# Altium schematic sheet ESC_prototype_1_schematic.SchDoc
size 420 x 297 mm; SheetNumber: 1; SheetTotal: 1
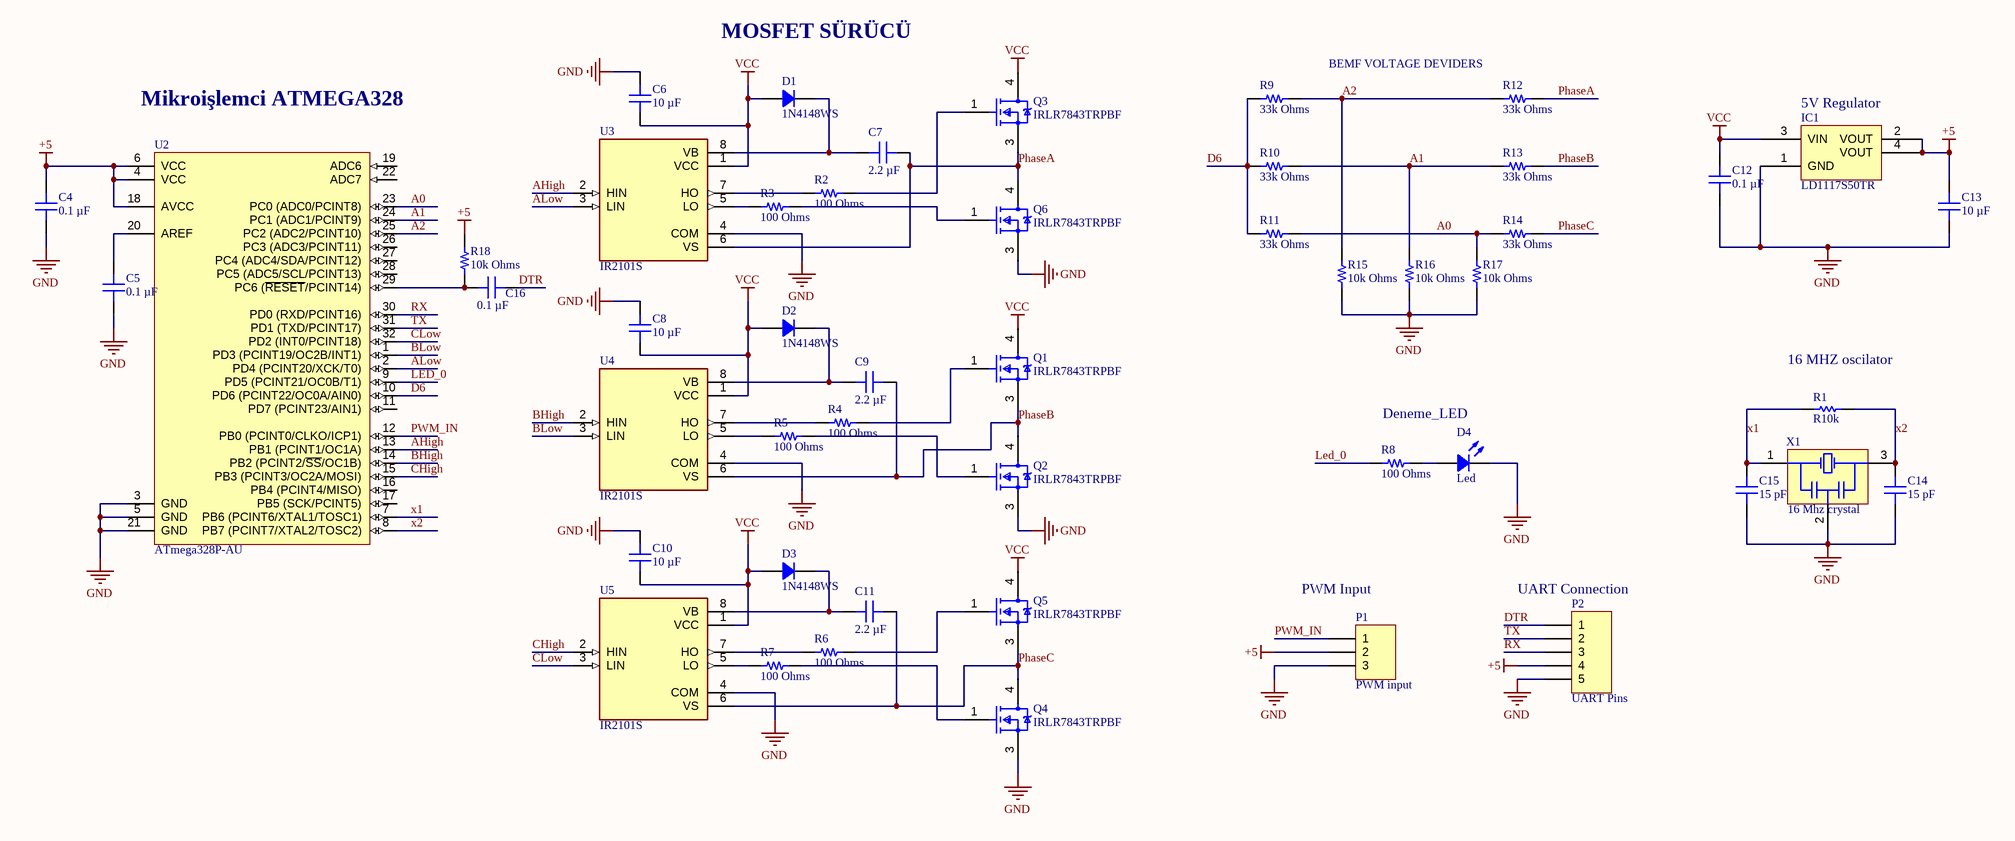
[diagram p0: ESC_prototype_1_schematic.SchDoc]

## Parts
C4  0.1 µF  [CAP 0805_2012]
C5  0.1 µF  [CAP 0805_2012]
C6  10 µF  [CAP 1206_3216 - 0.8MM]
C7  2.2 µF  [CAP 0805_2012]
C8  10 µF  [CAP 1206_3216 - 0.8MM]
C9  2.2 µF  [CAP 0805_2012]
C10  10 µF  [CAP 1206_3216 - 0.8MM]
C11  2.2 µF  [CAP 0805_2012]
C12  0.1 µF  [CAP 0805_2012]
C13  10 µF  [CAP 1206_3216 - 0.8MM]
C14  15 pF  [CAP 0805_2012]
C15  value 15 pF  [CAP 0805_2012]  (hidden comment: 15)
C16  0.1 µF  [CAP 0805_2012]
D1  1N4148WS  [SOD323F]
D2  1N4148WS  [SOD323F]
D3  1N4148WS  [SOD323F]
D4  Led  [CREE J 2835]
IC1  LD1117S50TR  [ST SOT-223]
P1  PWM input  [HDR1X3]
P2  UART Pins  [HDR1X5]
Q1  IRLR7843TRPBF  [FP-PG-TO252-3-MFG]
Q2  IRLR7843TRPBF  [FP-PG-TO252-3-MFG]
Q3  IRLR7843TRPBF  [FP-PG-TO252-3-MFG]
Q4  IRLR7843TRPBF  [FP-PG-TO252-3-MFG]
Q5  IRLR7843TRPBF  [FP-PG-TO252-3-MFG]
Q6  IRLR7843TRPBF  [FP-PG-TO252-3-MFG]
R1  R10k  [RESC1608X55X25ML10T15]
R2  100 Ohms  [RES 0603_1608]
R3  100 Ohms  [RES 0603_1608]
R4  100 Ohms  [RES 0603_1608]
R5  100 Ohms  [RES 0603_1608]
R6  100 Ohms  [RES 0603_1608]
R7  100 Ohms  [RES 0603_1608]
R8  100 Ohms  [RES 0603_1608]
R9  33k Ohms  [RES 0603_1608]
R10  33k Ohms  [RES 0603_1608]
R11  33k Ohms  [RES 0603_1608]
R12  33k Ohms  [RES 0603_1608]
R13  33k Ohms  [RES 0603_1608]
R14  33k Ohms  [RES 0603_1608]
R15  10k Ohms  [RES 0603_1608]
R16  10k Ohms  [RES 0603_1608]
R17  10k Ohms  [RES 0603_1608]
R18  10k Ohms  [RES 0603_1608]
U2  ATmega328P-AU  [32A_M]
U3  IR2101S  [SOIC127P600X175-8N]
U4  IR2101S  [SOIC127P600X175-8N]
U5  IR2101S  [SOIC127P600X175-8N]
X1  16 Mhz crystal  [MURA-CSTCE_G_A-3_V]

## Nets
+5: C4.2 C13.2 IC1.2(VOUT) IC1.4(VOUT) P1.2 P2.4 R18.2 U2.4(VCC) U2.6(VCC) U2.18(AVCC)
GND: C4.1 C5.1 C6.2 C8.2 C10.2 C12.1 C13.1 C14.1 C15.1 D4.2 IC1.1(GND) P1.3 P2.5 Q2.3(SOURCE) Q4.3(SOURCE) Q6.3(SOURCE) R15.1 R16.1 R17.1 U2.3(GND) U2.5(GND) U2.21(GND) U3.4(COM) U4.4(COM) U5.4(COM) X1.2(GND)
VCC: C6.1 C8.1 C10.1 C12.2 D1.1 D2.1 D3.1 IC1.3(VIN) Q1.4(DRAIN) Q3.4(DRAIN) Q5.4(DRAIN) U3.1(VCC) U4.1(VCC) U5.1(VCC)
A0: R11.2 R14.1 R17.2 U2.23(PC0_(ADC0/PCINT8))
A1: R10.2 R13.1 R16.2 U2.24(PC1_(ADC1/PCINT9))
A2: R9.2 R12.1 R15.2 U2.25(PC2_(ADC2/PCINT10))
AHigh: U2.13(PB1_(PCINT1/OC1A)) U3.2(HIN)
ALow: U2.2(PD4_(PCINT20/XCK/T0)) U3.3(LIN)
BHigh: U2.14(PB2_(PCINT2/~{SS}/OC1B)) U4.2(HIN)
BLow: U2.1(PD3_(PCINT19/OC2B/INT1)) U4.3(LIN)
CHigh: U2.15(PB3_(PCINT3/OC2A/MOSI)) U5.2(HIN)
CLow: U2.32(PD2_(INT0/PCINT18)) U5.3(LIN)
D6: R9.1 R10.1 R11.1 U2.10(PD6_(PCINT22/OC0A/AIN0))
DTR: C16.2 P2.1
LED_0: R8.1 U2.9(PD5_(PCINT21/OC0B/T1))
PhaseA: C7.2 Q3.3(SOURCE) Q6.4(DRAIN) R12.2 U3.6(VS)
PhaseB: C9.2 Q1.3(SOURCE) Q2.4(DRAIN) R13.2 U4.6(VS)
PhaseC: C11.2 Q4.4(DRAIN) Q5.3(SOURCE) R14.2 U5.6(VS)
PWM_IN: P1.1 U2.12(PB0_(PCINT0/CLKO/ICP1))
RX: P2.3 U2.30(PD0_(RXD/PCINT16))
TX: P2.2 U2.31(PD1_(TXD/PCINT17))
x1: C15.2 R1.2 U2.7(PB6_(PCINT6/XTAL1/TOSC1)) X1.1(X1)
x2: C14.2 R1.1 U2.8(PB7_(PCINT7/XTAL2/TOSC2)) X1.3(X2)
NetC5_2: C5.2 U2.20(AREF)
NetC7_1: C7.1 D1.2 U3.8(VB)
NetC9_1: C9.1 D2.2 U4.8(VB)
NetC11_1: C11.1 D3.2 U5.8(VB)
NetC16_1: C16.1 R18.1 U2.29(PC6_(~{RESET}/PCINT14))
NetD4_1: D4.1 R8.2
NetQ1_1: Q1.1(GATE) R4.2
NetQ2_1: Q2.1(GATE) R5.2
NetQ3_1: Q3.1(GATE) R2.2
NetQ4_1: Q4.1(GATE) R7.2
NetQ5_1: Q5.1(GATE) R6.2
NetQ6_1: Q6.1(GATE) R3.2
NetR2_1: R2.1 U3.7(HO)
NetR3_1: R3.1 U3.5(LO)
NetR4_1: R4.1 U4.7(HO)
NetR5_1: R5.1 U4.5(LO)
NetR6_1: R6.1 U5.7(HO)
NetR7_1: R7.1 U5.5(LO)

Not connected (* = marked no-connect by the designer): U2 11(PD7_(PCINT23/AIN1)) 16(PB4_(PCINT4/MISO)) 17(PB5_(SCK/PCINT5)) 19(ADC6) 22(ADC7) 26(PC3_(ADC3/PCINT11)) 27(PC4_(ADC4/SDA/PCINT12)) 28(PC5_(ADC5/SCL/PCINT13))

## Notes on the sheet
- MOSFET SÜRÜCÜ
- BEMF VOLTAGE DEVIDERS
- Mikroişlemci ATMEGA328
- (near IC1) 5V Regulator
- Deneme_LED
- (near R1) 16 MHZ oscilator
- (near P1) PWM Input
- (near P2) UART Connection
- THIS DOCUMENT AND THE DATA DISCLOSED HEREIN OR
- HEREWITH IS THE PROPERTY OF ALTIUM LIMITED AND MAY
- DWG NO:
- REVISION
- REV:
- DESCRIPTION
- DATE
- APPROVED
- BE FREELY DISTRIBUTED IN WHOLE. NO RIGHTS ARE
- RESERVED OR EXPRESS OR IMPLIED WARANTEE GIVEN.
- ENG:
- APPROVALS
- PROJECT
- DSN:
- CHK:
- REFERENCE DOCUMENTS
- PROJECT REVISION:
- TITLE
- DOCUMENT REVISION:
- DESIGN ITEM:
- BOM:
- FAB DWG:
- PCB DWG:
- ASSY DWG:
- SCALE:
- A3
- SIZE
- CAGE CODE
- FILE NAME
- DWG NO.
- SHEET
- OF
- REV

## Library data of the parts
C4 C5 C12 C16 = CL21B104KBCNNNC: CAP CER 0.1UF 50V X7R 0805; manufacturer: Samsung Electro-Mechanics; Tolerance: ±10%; Part Number: CL21B104KBCNNNC; Value: 0.1 µF; Applications: General Purpose; Capacitance: 0.1 µF; componentlink1description: Datasheet; componentlink1url: http://www.samsungsem.com/kr/support/product-search/mlcc/CL21B104KBCNNNC.jsp; componentlink2description: DigiKey Link; componentlink2url: https://www.digikey.com/en/products/detail/samsung-electro-mechanics/CL21B104KBCNNNC/3886661; Device Package: 0805 (2012 Metric); Lifecycle Status: Active; Minimum Order: 1; Mounting Type: Surface Mount, MLCC; Operating Temperature: -55°C ~ 125°C; Package / Case: 0805 (2012 Metric); packaging: TapeAndReel; partid: 6201; Part Status: Active; price: 0.01; series: CL; Size / Dimension: 0.079" L x 0.049" W (2.00mm x 1.25mm); Supplier 1: DigiKey; Supplier Part Number 1: 1276-1003-1-ND; Temperature Coefficient: X7R; Thickness (Max): 0.037" (0.95mm); Voltage - Rated: 50V
  C4 C5: lastupdated: 3/11/2022 5:29:47 AM
  C12 C16: lastupdated: 3/17/2022 8:29:34 AM
C6 C8 C10 C13 = CL31A106KACLNNC: CAP CER 10UF 25V X5R 1206; manufacturer: Samsung Electro-Mechanics; Tolerance: ±10%; Part Number: CL31A106KACLNNC; Value: 10 µF; Applications: General Purpose; Capacitance: 10 µF; componentlink1description: Datasheet; componentlink1url: http://www.samsungsem.com/kr/support/product-search/mlcc/CL31A106KACLNNC.jsp; componentlink2description: DigiKey Link; componentlink2url: https://www.digikey.com/en/products/detail/samsung-electro-mechanics/CL31A106KACLNNC/3888378; Device Package: 1206 (3216 Metric); Features: Low Profile; lastupdated: 3/11/2022 5:31:45 AM; Lifecycle Status: Active; Minimum Order: 1; Mounting Type: Surface Mount, MLCC; Operating Temperature: -55°C ~ 85°C; Package / Case: 1206 (3216 Metric); packaging: TapeAndReel; partid: 20311; Part Status: Active; price: 0.04; series: CL; Size / Dimension: 0.126" L x 0.063" W (3.20mm x 1.60mm); Supplier 1: DigiKey; Supplier Part Number 1: 1276-2720-1-ND; Temperature Coefficient: X5R; Thickness (Max): 0.037" (0.95mm); Voltage - Rated: 25V
C7 C9 C11 = CL21A225KBFNNNE: CAP CER 2.2UF 50V X5R 0805; manufacturer: Samsung Electro-Mechanics; Tolerance: ±10%; Part Number: CL21A225KBFNNNE; Value: 2.2 µF; Applications: General Purpose; Capacitance: 2.2 µF; componentlink1description: Datasheet; componentlink1url: http://www.samsungsem.com/kr/support/product-search/mlcc/CL21A225KBFNNNE.jsp; componentlink2description: DigiKey Link; componentlink2url: https://www.digikey.com/en/products/detail/samsung-electro-mechanics/CL21A225KBFNNNE/5961186; Device Package: 0805 (2012 Metric); lastupdated: 3/11/2022 5:29:51 AM; Lifecycle Status: Active; Minimum Order: 1; Mounting Type: Surface Mount, MLCC; Operating Temperature: -55°C ~ 85°C; Package / Case: 0805 (2012 Metric); packaging: TapeAndReel; partid: 4762; Part Status: Active; price: 0.04; series: CL; Size / Dimension: 0.079" L x 0.049" W (2.00mm x 1.25mm); Supplier 1: DigiKey; Supplier Part Number 1: 1276-6702-1-ND; Temperature Coefficient: X5R; Thickness (Max): 0.053" (1.35mm); Voltage - Rated: 50V
C14 C15 = CL21C101JB61PNC: CAP CER 100PF 50V C0G/NP0 0805; manufacturer: Samsung Electro-Mechanics; Temperature Coefficient: C0G, NP0; Tolerance: ±5%; Part Number: CL21C101JB61PNC; Applications: Automotive; Capacitance: 15 pF; componentlink1description: Datasheet; componentlink1url: http://www.samsungsem.com/kr/support/product-search/mlcc/CL21C101JB61PNC.jsp; componentlink2description: DigiKey Link; componentlink2url: https://www.digikey.com/en/products/detail/samsung-electro-mechanics/CL21C101JB61PNC/3888225; Device Package: 0805 (2012 Metric); lastupdated: 3/17/2022 8:29:31 AM; Lifecycle Status: Active; Minimum Order: 1; Mounting Type: Surface Mount, MLCC; Operating Temperature: -55°C ~ 125°C; Package / Case: 0805 (2012 Metric); packaging: TapeAndReel; partid: 7790; Part Status: Active; price: 0.02; Ratings: AEC-Q200; series: CL; Size / Dimension: 0.079" L x 0.049" W (2.00mm x 1.25mm); Supplier 1: DigiKey; Supplier Part Number 1: 1276-2567-1-ND; Thickness (Max): 0.028" (0.70mm); Voltage - Rated: 50V
  C14: Value: 15 pF
D1-D3 = 1N4148WS: DIODE GEN PURP 75V 150MA SOD323F; Manufacturer: ON Semiconductor; Current - Reverse Leakage @ Vr: 5µA @ 75V; Diode Type: Standard; Reverse Recovery Time (trr): 4ns; Speed: Small Signal =< 200mA (Io), Any Speed; Voltage - Forward (Vf) (Max) @ If: 1V @ 10mA; Part Number: 1N4148WS; ComponentLink1Description: Datasheet; ComponentLink1URL: https://www.onsemi.com/pub/Collateral/1N914BWS-D.pdf; ComponentLink2Description: DigiKey Link; ComponentLink2URL: http://digikey.com/product-detail/en/on-semiconductor/1N4148WS/1N4148WSFSCT-ND/1873821; Current - Average Rectified (Io): 150mA; LastUpdated: 3/11/2022 6:04:11 AM; Lifecycle Status: Active; Minimum Order: 1; Mounting Type: Surface Mount; Operating Temperature - Junction: 150°C (Max); Package / Case: SC-90, SOD-323F; Packaging: TapeAndReel; PartId: 1158; Part Status: Active; Price: 0.03; Series: -; Supplier 1: DigiKey; Supplier Part Number 1: 1N4148WSFSCT-ND; Supplier Device Package: SOD-323F; Voltage - DC Reverse (Vr) (Max): 75V
D4 = JE2835AWT-R-H30GA0000-N0000001: LED WHITE  3000K JE2835 3V; Manufacturer: Cree Inc.; CCT (K): 3000K 3-Step MacAdam Ellipse; CRI (Color Rendering Index): 80; Current - Max: 240mA; Current - Test: 150mA; Flux @ 25°C, Current - Test: 70lm (Typ); Flux @ 85°C, Current - Test: 60lm (Typ); Lumens/Watt @ Current - Test: 158 lm/W; Viewing Angle: 120°; Voltage - Forward (Vf) (Typ): 2.95V; Part Number: JE2835AWT-R-H30GA0000-N0000001; ComponentLink1Description: Datasheet; ComponentLink1URL: https://www.cree.com/led-components/media/documents/data-sheet-JSeries-2835-3v.pdf; ComponentLink2Description: DigiKey Link; ComponentLink2URL: http://digikey.com/product-detail/en/cree-inc/JE2835AWT-R-H30GA0000-N0000001/2138-JE2835AWT-R-H30GA0000-N0000001CT-ND/10820199; Device Package: 1113 (2835 Metric); LastUpdated: 3/11/2022 6:21:18 AM; Lifecycle Status: Active; Minimum Order: 1; Mounting Type: Surface Mount; Package / Case: 1113 (2835 Metric); Packaging: TapeAndReel; PartId: 60; Part Status: 1113 (2835 Metric); Price: 0.01; Series: J; Supplier 1: DigiKey; Supplier Part Number 1: 2138-JE2835AWT-R-H30GA0000-N0000001CT-ND; Supplier Device Package: SMD
IC1 = LD1117S50TR: IC REG LINEAR 5V 800MA SOT223; Manufacturer: STMicroelectronics; Current - Quiescent (Iq): 10mA; Number of Regulators: 1; Output Configuration: Positive; Output Type: Fixed; Protection Features: Over Current, Over Temperature; PSRR: 75dB (120Hz); Voltage Dropout (Max): 1.2V @ 800mA; Voltage - Input (Max): 15V; Part Number: LD1117S50TR; ComponentLink1Description: Datasheet; ComponentLink1URL: http://www.st.com/content/ccc/resource/technical/document/datasheet/99/3b/7d/91/91/51/4b/be/CD00000544.pdf/files/CD00000544.pdf/jcr:content/translations/en.CD00000544.pdf; ComponentLink2Description: DigiKey Link; ComponentLink2URL: http://digikey.com/product-detail/en/stmicroelectronics/LD1117S50TR/497-6447-1-ND/1865475; Current - Output: 800mA; LastUpdated: 3/17/2022 9:08:52 AM; Lifecycle Status: Active; Minimum Order: 1; Mounting Type: Surface Mount; Package / Case: TO-261-4, TO-261AA; Packaging: TapeAndReel; Part Status: Active; Price: 0.14; Series: -; Supplier 1: DigiKey; Supplier Part Number 1: 497-6447-1-ND; Supplier Device Package: SOT-223; Voltage - Output (Min/Fixed): 5V
P1 = Header 3: Header, 3-Pin; LatestRevisionDate: 17-Jul-2002; LatestRevisionNote: Re-released for DXP Platform.; Publisher: Altium Limited
P2 = Header 5: Header, 5-Pin; LatestRevisionDate: 17-Jul-2002; LatestRevisionNote: Re-released for DXP Platform.; Publisher: Altium Limited
Q1-Q6 = CMP-32901-000143-1: MOSFET N-CH 30V 161A DPAK; Manufacturer: Infineon; Drain To Source Resistance: 3.2mΩ; Depletion Mode: False; Reverse Recovery Time: 39ns; Reverse Recovery Charge: 36nC; Threshold Vgs Max: 2.3V; Rthja Max: 50°C/W; Threshold Vgs Min: 1.4V; Power Dissipation: 140W; Pulse Drain Current: 620A; Input Capacitace At Vds: 4380pF @ 15V; Turn On Delay Time: 25ns; Gate To Source Voltage: 20V; Max Forward Diode Voltage: 1V; Gate Charge At Vgs: 34nC @ 4.5V; Max Junction Temp: +175°C; Number Of Channels: 1; Turn Off Delay Time: 34ns; ComponentLink2URL: https://www.infineon.com/dgdl/irlr7843pbf.pdf?fileId=5546d462533600a40153566de53526d8; Temperature Range High: +175°C; Octopart: https://octopart.com/irlr7843trpbf-infineon-65875062; Temperature: -55°C to +175°C; Device Class L3: MOSFETs; Manufacturer Part Number: IRLR7843TRPBF; Category: Trans; Package: PG-TO252-3; Footprint Url: https://www.infineon.com/cms/en/product/packages/PG-TO252/PG-TO252-3-901/; Continuous Drain Current: 161A; Digikey Description: MOSFET N-CH 30V 161A DPAK; Automotive: No; Lead Free: Yes; Drain To Source Breakdown Voltage: 30V; Height: 2.52mm; Temperature Range Low: -55°C; RoHS: TRUE; Number Of N Channels: 1; Drain To Source Voltage: 30V; ComponentLink2Description: Datasheet; Device Class L2: Transistors; Device Class L1: Discrete Semiconductors
R1 = CMP-2100-03667-1: Chip Resistor, 0 Ohm, +/- 5%, 0.1 W, -55 to 155 degC, 0603 (1608 Metric), RoHS, Tape and Reel; Manufacturer: Yageo; Temperature Coefficient: 200ppm/degreesC; Voltage Rating: 50V; Power Rating: 100mW; Resistance: 0mOhm; Width: 0.8mm; Max Operating Temperature: 155degC; Tolerance: 5%; Package Reference: 0603; Height: 0.45mm; Depth: 0.8mm; Package Description: 2-Pin Surface Mount Device, Body 1.6 x 0.8 mm; Termination: SMD/SMT; Package Quantity: 5000; Case/Package: 0603; Case Code (Imperial): 0603; Radiation Hardening: No; Number of Pins: 2; Length: 1.6mm; Lead Free: LeadFree; Voltage Rating (DC): 50V; Military Standard: Not; Datasheet URL: http://www.yageo.com/NewPortal/yageodocoutput?fileName=/pdf/R-Chip/PYu-RC_Group_51_RoHS_L_5.pdf; Manufacturer URL: http://www.yageo.com/; Packaging: TapeandReel; Case Code (Metric): 1608; Min Operating Temperature: -55degC; Composition: ThickFilm; RoHSCompliant: true; Contact Plating: Tin; Datasheet Version: Rev. 5, 10/2016; REACH SVHC: NoSVHC
R2-R8 = RNCS0603BKE100R: RES 100 OHM 0.1% 1/16W 0603; Manufacturer: Stackpole Electronics Inc; Power (Watts): 0.063W, 1/16W; Temperature Coefficient: ±25ppm/°C; Part Number: RNCS0603BKE100R; Value: 100 Ohms; ComponentLink1Description: Datasheet; ComponentLink1URL: https://www.seielect.com/catalog/sei-rncs_rnch.pdf; ComponentLink2Description: DigiKey Link; ComponentLink2URL: https://www.digikey.com/en/products/detail/stackpole-electronics-inc/RNCS0603BKE100R/1799988; Composition: Thin Film; Device Package: 0603 (1608 Metric); Features: Anti-Corrosive, Automotive AEC-Q200, Moisture Resistant; Height - Seated (Max): 0.022" (0.55mm); LastUpdated: 3/11/2022 5:45:14 AM; Lifecycle Status: Active; Minimum Order: 1; Number of Terminations: 2; Operating Temperature: -55°C ~ 155°C; Package / Case: 0603 (1608 Metric); Packaging: TapeAndReel; PartId: 4839; Part Status: Active; Price: 0.08; Ratings: AEC-Q200; Resistance: 100 Ohms; Series: RNCS; Size / Dimension: 0.061" L x 0.031" W (1.55mm x 0.80mm); Supplier 1: DigiKey; Supplier Part Number 1: RNCS0603BKE100RCT-ND; Supplier Device Package: 0603; Tolerance: ±0.1%
R9-R18 = RNCS0603BKE100R: RES 100 OHM 0.1% 1/16W 0603; Manufacturer: Stackpole Electronics Inc; Power (Watts): 0.063W, 1/16W; Resistance: 100 Ohms; Temperature Coefficient: ±25ppm/°C; Part Number: RNCS0603BKE100R; ComponentLink1Description: Datasheet; ComponentLink1URL: https://www.seielect.com/catalog/sei-rncs_rnch.pdf; ComponentLink2Description: DigiKey Link; ComponentLink2URL: https://www.digikey.com/en/products/detail/stackpole-electronics-inc/RNCS0603BKE100R/1799988; Composition: Thin Film; Device Package: 0603 (1608 Metric); Features: Anti-Corrosive, Automotive AEC-Q200, Moisture Resistant; Height - Seated (Max): 0.022" (0.55mm); LastUpdated: 3/11/2022 5:45:14 AM; Lifecycle Status: Active; Minimum Order: 1; Number of Terminations: 2; Operating Temperature: -55°C ~ 155°C; Package / Case: 0603 (1608 Metric); Packaging: TapeAndReel; PartId: 4839; Part Status: Active; Price: 0.08; Ratings: AEC-Q200; Series: RNCS; Size / Dimension: 0.061" L x 0.031" W (1.55mm x 0.80mm); Supplier 1: DigiKey; Supplier Part Number 1: RNCS0603BKE100RCT-ND; Supplier Device Package: 0603; Tolerance: ±0.1%
  R9-R14: Value: 33k Ohms
  R15-R18: Value: 10k Ohms
U2 = CMP-0095-00269-2: 8-bit AVR Microcontroller, 32KB Flash, 1KB EEPROM, 2KB SRAM, 32-pin TQFP, Industrial Grade (-40°C to 85°C); PackageDescription: 32-Lead, 7x7x1.0 mm Body, 0.8mm Lead Pitch, Thin Profile Plastic Quad Flat Package (TQFP); DatasheetVersion: revD, May-2011; RevisionNote: DatasheetVersion & PackageVersion updated. URLs added.; ComponentLink1URL: http://www.atmel.com/; ComponentLink2Description: ATmega48A/48PA/88A/88PA/168A/168PA/328/328P Datasheet; Code_JEDEC: MS-026-ABA; ComponentLink1Description: Manufacturer URL; PackageReference: 32A; ComponentLink3Description: ATmega48A/48PA/88A/88PA/168A/168PA/328/328P Summary; ComponentLink2URL: http://www.atmel.com/dyn/resources/prod_documents/doc8271.pdf; PackageVersion: revC, Oct-2010; ComponentLink3URL: http://www.atmel.com/dyn/resources/prod_documents/8271S.pdf
U3-U5 = IR2101S: Half-Bridge Gate Driver IC Non-Inverting 8-SOIC; MF: Infineon Technologies; Availability: Unavailable; Value: *; Package: SOIC-8 Infineon; Price: None; MP: IR2101S; SnapEDA_Link: https://www.snapeda.com/parts/IR2101S/Infineon%20Technologies/view-part/589975/?ref=snap
X1 = CMP-2100-03620-1: Ceramic Resonator, 8 MHz, +/- 0.5%, -20 to 80 degC, 3-Pin SMD, RoHS, Tape and Reel; Manufacturer: Murata; Capacitance: 33pF; Frequency Stability: 0.2%; Self Resonant Frequency: 8MHz; Datasheet Version: 42339.0; RoHSCompliant: True; Datasheet URL: http://www.murata.com/~/media/webrenewal/support/library/catalog/products/timingdevice/ceralock/p16e.ashx; Case/Package: Ceramic; Load Capacitance: 33pF; Tolerance: 0.5%; Mount: SurfaceMount; Height: 0.031inch; Number of Pins: 3; Package Description: 3-Pin Surface Mount Device, Body 3.2 x 1.3 mm, Pitch 1.2 mm; Package Quantity: 1; Lead Free: LeadFree; Contact Plating: Gold; REACH SVHC: NoSVHC; Length: 0.126inch; Width: 0.051inch; Manufacturer URL: http://www.murata.com/; Packaging: TapeandReel; Termination: SMD/SMT; Frequency Tolerance: 0.5%; Max Operating Temperature: 80degC; Composition: Ceramic; Package Reference: CSTCE_G_A-3; Min Operating Temperature: -20degC; Frequency: 8MHz